# Altium schematic sheet MCU_IO.SchDoc: SYNCHRONIZED ACOUSTIC TRIGGER
size A3; DocumentNumber: PCB-237-SCH-001; Revision: 2; SheetNumber: 1; SheetTotal: 1; Date: 24 NOV 2023; DrawnBy: JOY; Header: MCU; DRAWNBY1: JOY; DRAWNBY2: JOY; CHACKEDBY1: LWL; APPROVEDBY1: SCC; DESCRIPTION1: INITIAL RELEASE; DESCRIPTION2: ADDED DIODE AND FIXED RESET PROBLEM; ISSUE1: 1; ISSUE2: 2; DATE1: 27.11.23
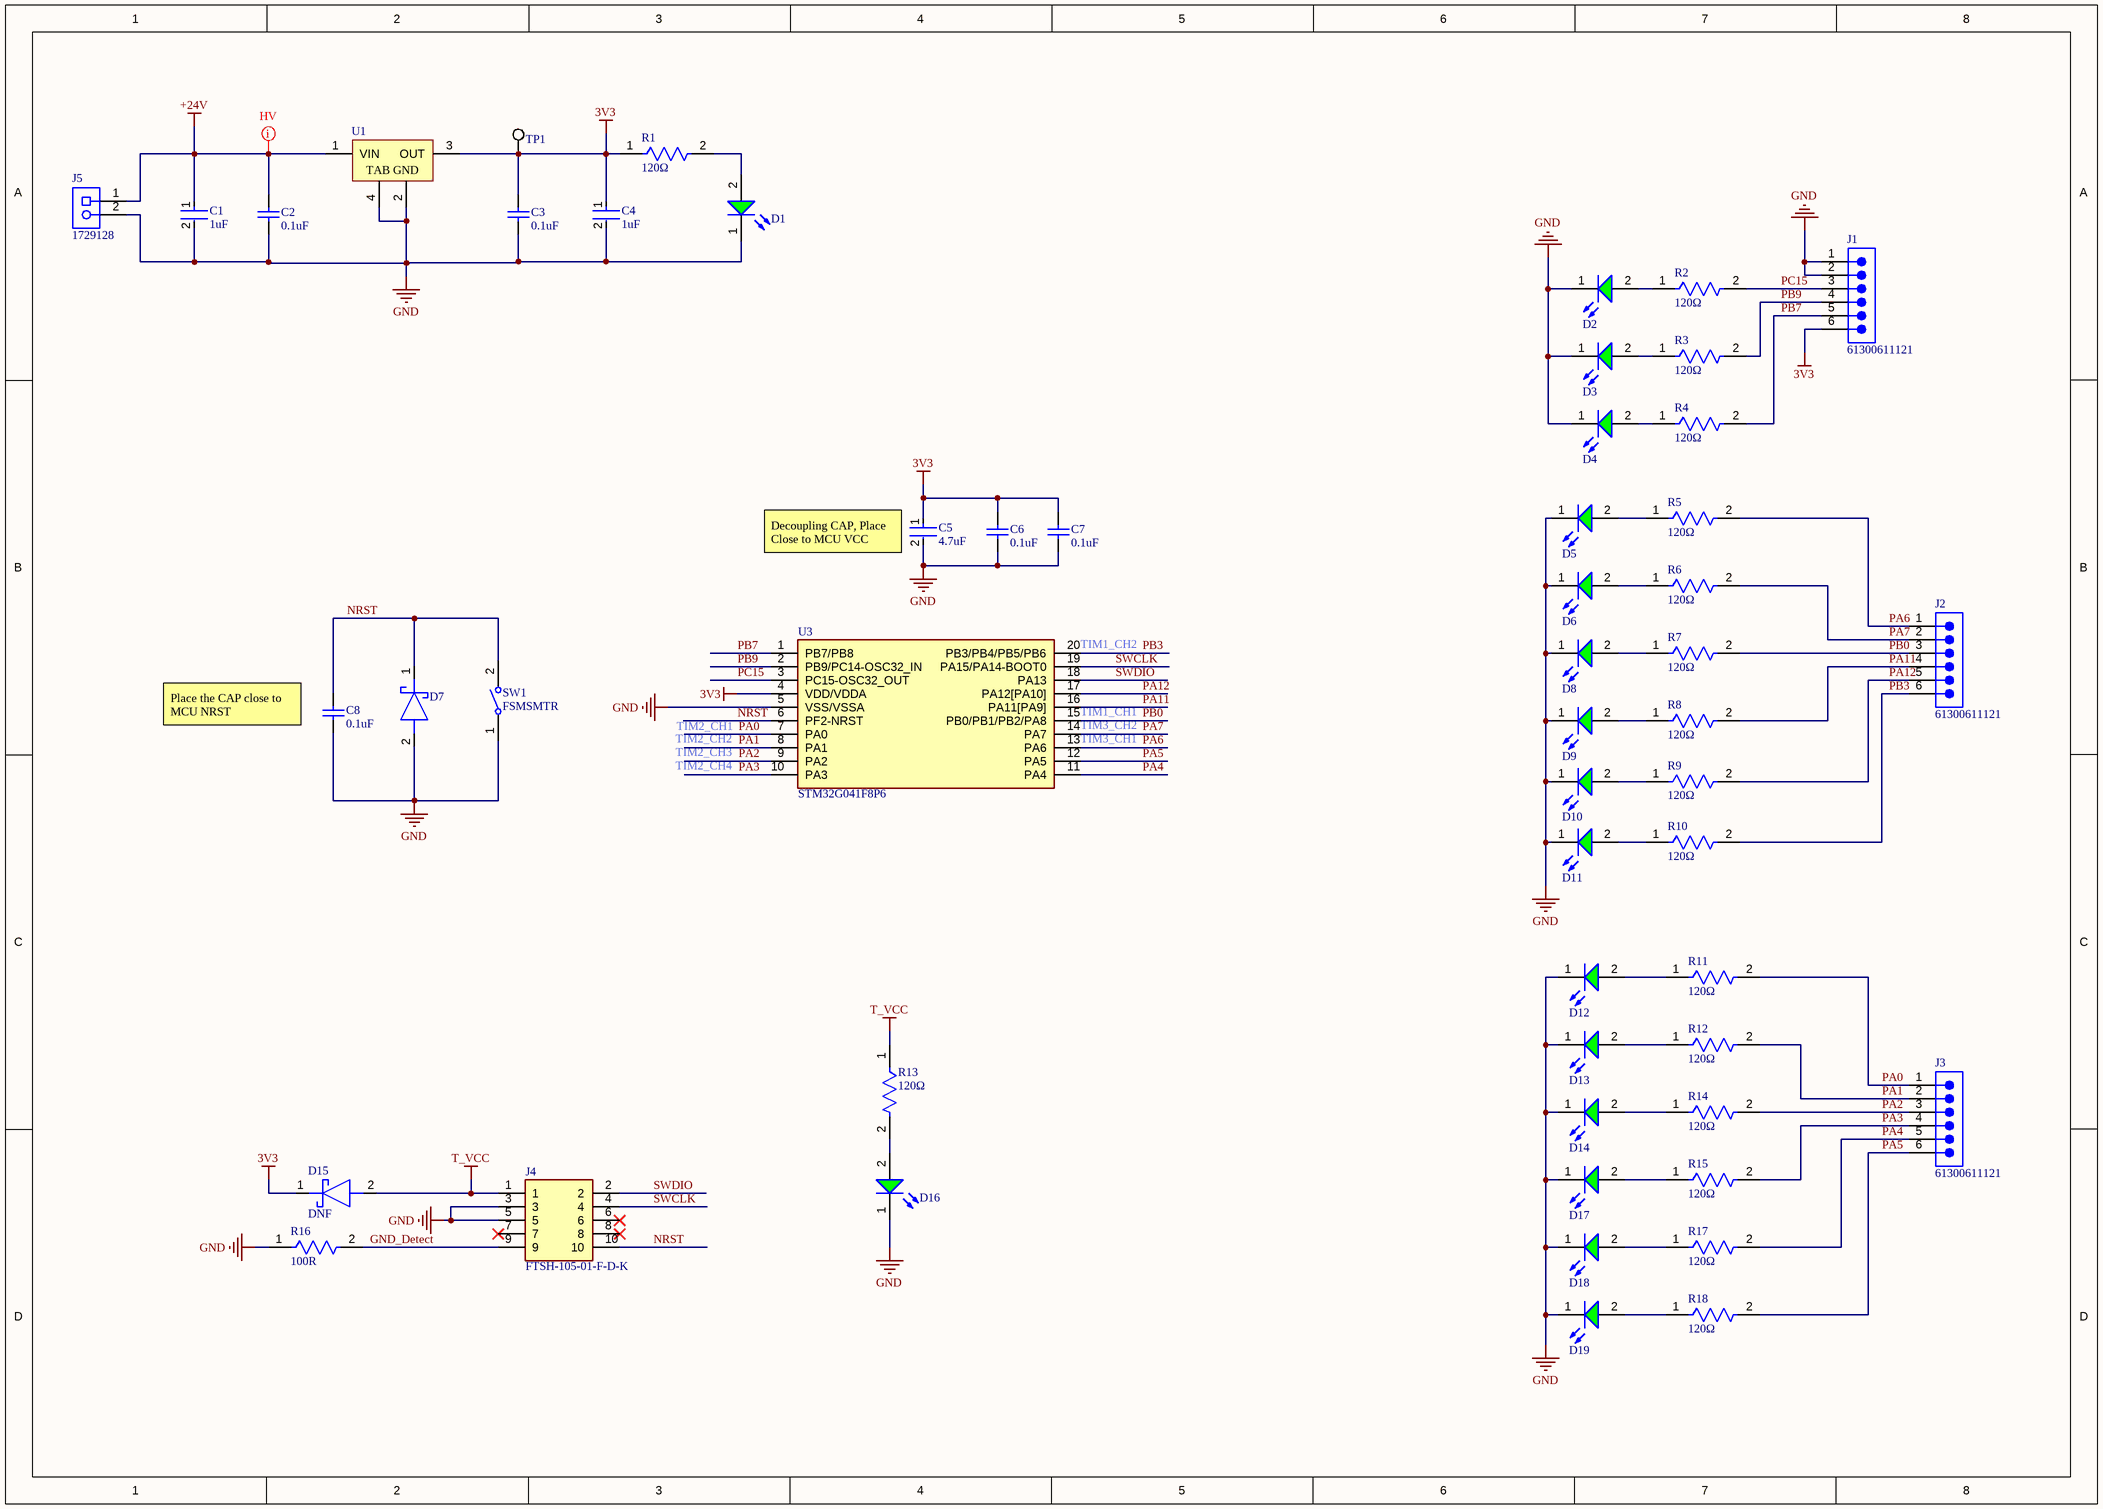
[diagram p0: MCU_IO.SchDoc]

## Parts
C1  Capacitance: 1uF  [FP-CC0805-0_2-1_45-MFG]  (hidden comment: CC0805JKX7R9BB105)
C2  value 0.1uF  [CAPC2013X94X50ML25T25]  (hidden comment: LD051C104KAB2A)
C3  value 0.1uF  [CAPC2013X94X50ML25T25]  (hidden comment: LD051C104KAB2A)
C4  Capacitance: 1uF  [FP-CC0805-0_2-1_45-MFG]  (hidden comment: CC0805JKX7R9BB105)
C5  Capacitance: 4.7uF  [FP-CGA4J-IPC_B]  (hidden comment: CGA4J3X7R1C475M125AE)
C6  value 0.1uF  [CAPC2013X94X50ML25T25]  (hidden comment: LD051C104KAB2A)
C7  value 0.1uF  [CAPC2013X94X50ML25T25]  (hidden comment: LD051C104KAB2A)
C8  value 0.1uF  [CAPC2013X94X50ML25T25]  (hidden comment: LD051C104KAB2A)
D1  150080GS75000  [WL-SMCW_0805_150080xx75000]  (value not drawn)
D2  150080GS75000  [WL-SMCW_0805_150080xx75000]  (value not drawn)
D3  150080GS75000  [WL-SMCW_0805_150080xx75000]  (value not drawn)
D4  150080GS75000  [WL-SMCW_0805_150080xx75000]  (value not drawn)
D5  150080GS75000  [WL-SMCW_0805_150080xx75000]  (value not drawn)
D6  150080GS75000  [WL-SMCW_0805_150080xx75000]  (value not drawn)
D7  SD0805S020S1R0  [SD0805S020S1R0]  (value not drawn)
D8  150080GS75000  [WL-SMCW_0805_150080xx75000]  (value not drawn)
D9  150080GS75000  [WL-SMCW_0805_150080xx75000]  (value not drawn)
D10  150080GS75000  [WL-SMCW_0805_150080xx75000]  (value not drawn)
D11  150080GS75000  [WL-SMCW_0805_150080xx75000]  (value not drawn)
D12  150080GS75000  [WL-SMCW_0805_150080xx75000]  (value not drawn)
D13  150080GS75000  [WL-SMCW_0805_150080xx75000]  (value not drawn)
D14  150080GS75000  [WL-SMCW_0805_150080xx75000]  (value not drawn)
D15  DNF  [SD0805S020S1R0]
D16  150080GS75000  [WL-SMCW_0805_150080xx75000]  (value not drawn)
D17  150080GS75000  [WL-SMCW_0805_150080xx75000]  (value not drawn)
D18  150080GS75000  [WL-SMCW_0805_150080xx75000]  (value not drawn)
D19  150080GS75000  [WL-SMCW_0805_150080xx75000]  (value not drawn)
J1  61300611121  [61300611121]
J2  61300611121  [61300611121]
J3  61300611121  [61300611121]
J4  FTSH-105-01-F-D-K  [FTSH-105-XX-YYY-D-K]
J5  1729128  [PHOE-1729128-2_V]
R1  Resistance: 120Ω  [FP-CRGP0805-IPC_C]  (hidden comment: CRGP0805F120R)
R2  Resistance: 120Ω  [FP-CRGP0805-IPC_C]  (hidden comment: CRGP0805F120R)
R3  Resistance: 120Ω  [FP-CRGP0805-IPC_C]  (hidden comment: CRGP0805F120R)
R4  Resistance: 120Ω  [FP-CRGP0805-IPC_C]  (hidden comment: CRGP0805F120R)
R5  Resistance: 120Ω  [FP-CRGP0805-IPC_C]  (hidden comment: CRGP0805F120R)
R6  Resistance: 120Ω  [FP-CRGP0805-IPC_C]  (hidden comment: CRGP0805F120R)
R7  Resistance: 120Ω  [FP-CRGP0805-IPC_C]  (hidden comment: CRGP0805F120R)
R8  Resistance: 120Ω  [FP-CRGP0805-IPC_C]  (hidden comment: CRGP0805F120R)
R9  Resistance: 120Ω  [FP-CRGP0805-IPC_C]  (hidden comment: CRGP0805F120R)
R10  Resistance: 120Ω  [FP-CRGP0805-IPC_C]  (hidden comment: CRGP0805F120R)
R11  Resistance: 120Ω  [FP-CRGP0805-IPC_C]  (hidden comment: CRGP0805F120R)
R12  Resistance: 120Ω  [FP-CRGP0805-IPC_C]  (hidden comment: CRGP0805F120R)
R13  Resistance: 120Ω  [FP-CRGP0805-IPC_C]  (hidden comment: CRGP0805F120R)
R14  Resistance: 120Ω  [FP-CRGP0805-IPC_C]  (hidden comment: CRGP0805F120R)
R15  Resistance: 120Ω  [FP-CRGP0805-IPC_C]  (hidden comment: CRGP0805F120R)
R16  Resistance: 100R  [FP-CRCW0805-HPe3-IPC_C]  (hidden comment: CRCW0805100RJNEAHP)
R17  Resistance: 120Ω  [FP-CRGP0805-IPC_C]  (hidden comment: CRGP0805F120R)
R18  Resistance: 120Ω  [FP-CRGP0805-IPC_C]  (hidden comment: CRGP0805F120R)
SW1  FSMSMTR  [TECO-FSMSMTR_V]
TP1  5019  [KSTN-5019_V]  (value not drawn)
U1  LT1129IST-3.3#TRPBF  [LT-ST-3-SOT-223_L]  (value not drawn)
U3  STM32G041F8P6  [CLT34BT6]

## Nets
3V3: C3.2 C4.1 C5.1 C6.2 C7.2 D15.1(K) J1.6 R1.1 TP1.1 U1.3(OUT) U3.4(VDD/VDDA)
+24V: C1.1 C2.2 J5.1 U1.1(VIN)
GND: C1.2 C2.1 C3.1 C4.2 C5.2 C6.1 C7.1 C8.1 D1.1(K) D2.1(K) D3.1(K) D4.1(K) D5.1(K) D6.1(K) D7.2(A) D8.1(K) D9.1(K) D10.1(K) D11.1(K) D12.1(K) D13.1(K) D14.1(K) D16.1(K) D17.1(K) D18.1(K) D19.1(K) J1.1 J1.2 J4.3 J4.5 J5.2 R16.1 SW1.1 U1.2(GND) U1.4(TAB) U3.5(VSS/VSSA)
T_VCC: D15.2(A) J4.1 R13.1
GND_Detect: J4.9 R16.2
NRST: C8.2 D7.1(K) J4.10 SW1.2 U3.6(PF2-NRST)
PA0: J3.1 R11.2 U3.7(PA0)
PA1: J3.2 R12.2 U3.8(PA1)
PA2: J3.3 R14.2 U3.9(PA2)
PA3: J3.4 R15.2 U3.10(PA3)
PA4: J3.5 R17.2 U3.11(PA4)
PA5: J3.6 R18.2 U3.12(PA5)
PA6: J2.1 R5.2 U3.13(PA6)
PA7: J2.2 R6.2 U3.14(PA7)
PA11: J2.4 R8.2 U3.16(PA11[PA9])
PA12: J2.5 R9.2 U3.17(PA12[PA10])
PB0: J2.3 R7.2 U3.15(PB0/PB1/PB2/PA8)
PB3: J2.6 R10.2 U3.20(PB3/PB4/PB5/PB6)
PB7: J1.5 R4.2 U3.1(PB7/PB8)
PB9: J1.4 R3.2 U3.2(PB9/PC14-OSC32_IN)
PC15: J1.3 R2.2 U3.3(PC15-OSC32_OUT)
SWCLK: J4.4 U3.19(PA15/PA14-BOOT0)
SWDIO: J4.2 U3.18(PA13)
NetD1_2: D1.2(A) R1.2
NetD2_2: D2.2(A) R2.1
NetD3_2: D3.2(A) R3.1
NetD4_2: D4.2(A) R4.1
NetD5_2: D5.2(A) R5.1
NetD6_2: D6.2(A) R6.1
NetD8_2: D8.2(A) R7.1
NetD9_2: D9.2(A) R8.1
NetD10_2: D10.2(A) R9.1
NetD11_2: D11.2(A) R10.1
NetD12_2: D12.2(A) R11.1
NetD13_2: D13.2(A) R12.1
NetD14_2: D14.2(A) R14.1
NetD16_2: D16.2(A) R13.2
NetD17_2: D17.2(A) R15.1
NetD18_2: D18.2(A) R17.1
NetD19_2: D19.2(A) R18.1

Not connected (* = marked no-connect by the designer): J4 6* 7* 8*

## Layout directives
rule Width Constraint [Pref Width = 35mil    Min Width = 20mil    Max Width = 50mil]: +24V

## Notes on the sheet
- (near C5) Decoupling CAP, Place Close to MCU VCC
- (near U3) TIM1_CH2
- (near C8) Place the CAP close to MCU NRST
- (near U3) TIM1_CH1
- TIM2_CH2
- TIM2_CH3
- TIM2_CH4
- TIM2_CH1
- (near U3) TIM3_CH2
- (near U3) TIM3_CH1

## Library data of the parts
C1 C4 = CMP-03422-001528-1: CAP CER 1UF 50V X7R 0805; Tolerance: 5%; Max Operating Temperature: 125°C; Case/Package: 0805; Packaging: Cut Tape; Voltage Rating: 50V; Mount: Surface Mount; Case Code (Metric): 2012; Case Code (Imperial): 0805; Min Operating Temperature: -55°C
C2 C3 C6-C8 = CMP-2007-04089-1: CAP CER 0.1UF 100V X7R 0805; Manufacturer: AVX Interconnect / Elco; Part Number: LD051C104KAB2A
C5 = CMP-08246-001080-1: Cap Ceramic 4.7uF 16V X7R 20% Pad SMD 0805 +125°C Automotive T/R; Width: 0.049inch; Features: Soft Termination; Ratings: AEC-Q200; Tolerance: 20%; Termination: SMD/SMT; Package Quantity: 1; Min Operating Temperature: -55°C; Dielectric: X7R; Max Operating Temperature: 125°C; Depth: 1.25mm; REACH SVHC: No SVHC; Voltage Rating: 16V; Voltage Rating (DC): 16V; Thickness: 0.049inch; Mount: Surface Mount; Weight: 0.000194oz; Case/Package: 0805; Length: 2mm; Packaging: Tape and Reel; Case Code (Metric): 2012; Height: 1.25mm; Case Code (Imperial): 0805
D1-D6 D8-D14 D16-D19 = CMP-1426-00007-2: NexarPartId: 29717780; Wavelength: 520nm; Forward Current: 100mA; Lens Style: Clear, Rectangular; Dominant Wavelength: 525nm; Max Junction Temperature (Tj): 95°C; Power Dissipation: 105mW; Luminous Intensity: 450mcd; Peak Wavelength: 515nm; Color: Green; Viewing Angle: 140°; Test Current: 20mA; Reverse Voltage: 5V; Forward Voltage: 3.2V; Mount: Surface Mount; REACH SVHC: Unknown; Min Operating Temperature: -40°C; Case Code (Imperial): 0805; Case/Package: 0805; Max Operating Temperature: 85°C; RoHS: Compliant; Length: 2mm; Height: 700µm; Width: 1.25mm; Case Code (Metric): 2012; Packaging: Tape and Reel; Max Reverse Voltage (DC): 5V
D7 D15 = SD0805S020S1R0: Schottky Diode; Manufacturer_Name: AVX; Datasheet Link: https://componentsearchengine.com/Datasheets/1/SD0805S020S1R0.pdf; Height: 1mm; Manufacturer_Part_Number: SD0805S020S1R0; Mouser Part Number: 581-SD0805S020S1R0; Mouser Price/Stock: https://www.mouser.co.uk/ProductDetail/AVX-Kyocera/SD0805S020S1R0?qs=jCA%252BPfw4LHbpkAoSnwrdjw%3D%3D; Arrow Part Number: SD0805S020S1R0; Arrow Price/Stock: https://www.arrow.com/en/products/sd0805s020s1r0/avx?region=nac
J1-J3 = CMP-1502-01070-2: NexarPartId: 20084590; Operating Supply Voltage: 250V; Current Rating: 3A; Number of Contacts: 6; Gender: Male; Connector Type: Male Pin; Pitch: 2.54mm; Contact Resistance: 20mΩ; Lead Free: Lead Free; REACH SVHC: Unknown; Number of Rows: 1; Color: Black; Min Operating Temperature: -40°C; Contact Material: Copper; Lead Pitch: 2.54mm; Contact Plating: Gold; Number of Pins: 6; Height: 8.89mm; Orientation: Vertical; Termination: Through Hole; Mount: Through Hole; RoHS: Compliant; Contact Gender: Male; Contact Mating Length: 5.9944mm; Voltage Rating: 250V; Number of Positions: 6; Housing Material: PBT; Packaging: Bulk; Max Operating Temperature: 105°C
J4 = FTSH-105-01-F-D-K: Connector; Manufacturer_Name: SAMTEC; Datasheet Link: http://suddendocs.samtec.com/prints/ftsh-1xx-xx-xxx-d-xxx-xx-mkt.pdf; Manufacturer_Part_Number: FTSH-105-01-F-D-K; Mouser Part Number: 200-FTSH10501FDK; Mouser Price/Stock: https://www.mouser.co.uk/ProductDetail/Samtec/FTSH-105-01-F-D-K?qs=FESYatJ8odIwRE%252Bc%2FZcQYA%3D%3D; Arrow Part Number: FTSH-105-01-F-D-K; Arrow Price/Stock: https://www.arrow.com/en/products/ftsh-105-01-f-d-k/samtec?region=europe
J5 = CMP-2000-05815-1: PCB Terminal Block, 13.5 A, 400 V, 2-Pin THD, RoHS, Bulk; Manufacturer: Phoenix Contact; Package Version: 03/2015; No. of Rows: 1; Pitch: 5.08mm; No. of Positions: 2; Voltage Rating: 400V; Current Rating: 13500mA; Manufacturer URL: http://www.phoenixcontact.com/; Datasheet URL: https://datasheet.ciiva.com/16046/1729128-16046181.pdf; RoHS: TRUE; Package URL: https://www.phoenixcontact.com/online/portal/pi/pxc/product_detail_page/!ut/p/b1/3VdJjqNKFDxLH8AFycySyWY2ozFsEPOMMQaDOX1XedGL_1Vdm5YXJleknhSKeBkvI6EA8ncAo3AYoDhBQGco6KN7VURTdemj9us_IEKEZo_YHiPAEWEFmDGOHMORkqKYCORBZxgL7ZoaZYcbFFUZ3fqxSY6GOuxydWUuHqz1ynmMFygu583Bob0Ewr6Sd_l-5m-kAueHiB0jpRwZwe58wwtkpxtMYd_LmGcDRU02dRNEyWt6Y2ti5pSyJ_reIkzIulrqApdnbT11V5jnCKbYNCvhEM1MCpPByat_X379-iThf08CI5GfOPqfBeS3BRoBOdD55AKVv0iLwCMq-2BrzXWSGRH7pUGD9uwXQjiph3xL0DKQwdGa0JImiIOmBNOestqgwTHSSs2oOep-78apyXQBvNi8ZLaFjvjWvcaUEBu0MC6Wbe-d6mB0FAebo2lUWinqYaZs5DAYzV0RP9yitUjnGJ0iI9xhZkT42OCQNUJJhkgWINNQLP2JFP6OpMg3JCVg70jqHT0lvKOnhHf0lPuOnnLf0VPuWx6_dxwUIvwk5WMkT0kLL1mh61l2yZVSzG3pYV_bqo-mj6uMKwKwdnnW8Jh5RTOJzMOA5c-eJDaZQw4mTMPH02PvS_ZAqNVjVTo2WyYLkwH_KU1mmmG5kjRhDqPXLwwVHvVOjCM60-fpXvTDfMGW1PVFVS1r4e4yVDk4ZdNbkUHvqPqQSeian4UD39fNKmachqdJ1NJbyk8rXT9mXTvPk3oE5meulKGgiruPJek-4I9hTT6G8ZLOyRSm2RRVbThERQad5OS28hdt4YW4vG0stgYYzsWsK4_7y6DZMjJSCqri1kyiZR5vD7pwIrNR7QwPHTcLTI5qT7eRlpHrdGiupYlqQDJ7zy_CND8fWWBoLRXxk1RVcXiBQwbTD4Xi7KL-FuO94t9xaqweXzH; PartNumber: 1729128; Package Description: 2-Pin Through Hole Device, Body 8.1 x 10.16 mm, Pitch 5.08 mm; Datasheet Version: 12/2013; Mounting Technology: ThroughHole; Orientation: Horizontal; Package Reference: 1729128-2; Packing: Bulk
R1-R15 R17 R18 = CMP-03211-003086-1: CRGP0805 120Ω 0.33W ±100ppm/°C 1% 150V; Manufacturer: TE; Tolerance: 0.01; Package: CRGP0805; Composition: Thick Film; Voltage Rating: 150V; Ambient Temperature Range High: +70°C; Temperature Range Low: -55°C; Device Class L2: Resistors; Value: 120Ω; RoHS: TRUE; Octopart: https://octopart.com/crgp0805f120r-te+connectivity-91018785; Device Class L3: Chip SMD Resistors; ComponentLink2URL: https://www.mouser.com/datasheet/2/418/NG_DS_9-1773463-9_A-1358566.pdf; Height: 0.65mm; Manufacturer Part Number: CRGP0805F120R; Category: Res; Automotive: No; Temperature: -55°C to +155°C; Lead Free: Yes; ComponentLink2Description: Datasheet; Series: CRGP; Device Class L1: Passive Components; Temperature Range High: +155°C; Temperature Coefficient: ±100ppm/°C; Ipc Land Pattern Name: RESC200125X55; Power Rating: 0.33W
R16 = CMP-02407-002130-1: RES Thick Film, 100Ω, 5%, 0.5W, 200ppm/°C, 0805; Voltage Rating: 150V; Power Rating: 330mW; Max Power Dissipation: 333mW; Max Operating Temperature: 155°C; Temperature Coefficient: 200ppm/°C; Case Code (Imperial): 0805; Lead Free: Lead Free; Composition: Thick Film; Case/Package: 0805; Package Quantity: 1; Number of Terminations: 2; Contact Plating: Tin; Radiation Hardening: No; Case Code (Metric): 2012; Height: 0.024inch; Features: Automotive AEC-Q200; Length: 0.079inch; Tolerance: 5%; Width: 0.049inch; Packaging: Tape and Reel; Termination: SMD/SMT; Weight: 0.000194oz; Min Operating Temperature: -55°C
SW1 = CMP-2000-07501-1: FSMSM Push Button Switch, 50 mA, -35 to 85 degC, 2-Pin SMD, RoHS, Tape and Reel; Manufacturer: TE Connectivity; Voltage Rating (DC): 24V; Electrical Life: 20000Cycles; Operating Force: 180gf; Switch Travel: 0.25mm; Contact Current Rating: 50mA; Case\/Package: SMD/SMT; Actuator Length: 1.07mm; Throw Configuration: SPST; Actuator Material: Polyamide; Contact Resistance: 100mOhm; Illumination Type: Illuminated; Max Voltage Rating (DC): 12V; Manufacturer URL: http://www.te.com/; Lead Free: LeadFree; Packaging: TapeandReel; Min Operating Temperature: -35degC; Mechanical Life: 20000Cycles; Mount: SurfaceMount; REACH SVHC: Unknown; Package Quantity: 1800; Package Reference: FSMSMTR; RoHSCompliant: true; Max Operating Temperature: 85degC; Orientation: Straight; ELV: Compliant; Datasheet URL: http://www.te.com/commerce/DocumentDelivery/DDEController?Action=showdoc&DocId=Customer+Drawing%7F1437566-3%7FC2%7Fpdf%7FEnglish%7FENG_CD_1437566-3_C2_1437566_3_1_c.dwg.pdf%7F1437566-4; Package Description: 2-Pin Surface Mount Device, Body 6 x 3.5 mm, Pitch 9.19 mm; Current Rating: 50mA; Contact Plating: Silver; Termination: GullWing; Datasheet Version: Rev. C2, 08/2014; Contact Material: Brass; Mounting Technology: SurfaceMount
TP1 = CMP-1672-00008-1: Test Point, 1 Position SMD, RoHS, Tape and Reel; ComponentLink1Description: Manufacturer URL; Package Quantity: 1000; DatasheetVersion: 03/2014; Packaging: Tape and Reel; ComponentLink2URL: http://www.keyelco.com/product-pdf.cfm?p=1357; ComponentLink1URL: http://www.keyelco.com/; Mount: Surface Mount; Contact Plating: Silver; PackageDescription: 1-Pin Surface Mount Device, Body 3.81 x 2.03 mm; Pins: 1; RoHSCompliant: True; Mounting Technology: Surface Mount; ComponentLink2Description: Datasheet; PackageReference: 5019
U1 = CMP-0476-01829-1: Micropower Low Dropout Regulator with Shutdown, 4.15 to 30 V Vin, 3.3 V Vout, 3-pin SOT223 (ST-3), -40 to 125 degC, Pb-Free, Tape and Reel; Manufacturer: Linear Technology; Iout(mA): 700; Number of Outputs: 1; Dropout Voltage(V): 0.45; Vin Max(V): 30; Output Voltage: 3.3 V; Vin Min(V): 4.15; Discrete Pass Element: no; PSRR(dB): 64; Isupply(mA): 0.05; Shutdown Current(uA): 16; ComponentLink1URL: http://www.linear.com/; ComponentLink1Description: Manufacturer URL; Packing: Tape and Reel; PartNumber: LT1129IST-3.3#TRPBF; ComponentLink2Description: Datasheet; PackageDescription: 3-Pin Plastic SOT-223, 3.505 x 6.505 mm Body, Pitch 2.3 mm; PackageVersion: Jun-10; ComponentLink3URL: http://cds.linear.com/docs/en/packaging/SOT_3_05-08-1630.pdf; DatasheetVersion: Rev. F; ComponentLink3Description: Package Specification; Mounting Technology: Surface Mount; RoHS: TRUE; PackageReference: ST-3; ComponentLink2URL: http://cds.linear.com/docs/en/datasheet/112935ff.pdf
U3 = STM32G041F8P6: Integrated Circuit; Manufacturer_Name: STMicroelectronics; Datasheet Link: https://www.st.com/resource/en/datasheet/stm32g041c6.pdf; Height: 1.2mm; Manufacturer_Part_Number: STM32G041F8P6; Mouser Part Number: 511-STM32G041F8P6; Mouser Price/Stock: https://www.mouser.co.uk/ProductDetail/STMicroelectronics/STM32G041F8P6?qs=xZ%2FP%252Ba9zWqayYoZl7%2Ff%252BOA%3D%3D